# Altium schematic sheet TinyFoc_v1.SchDoc
size A4
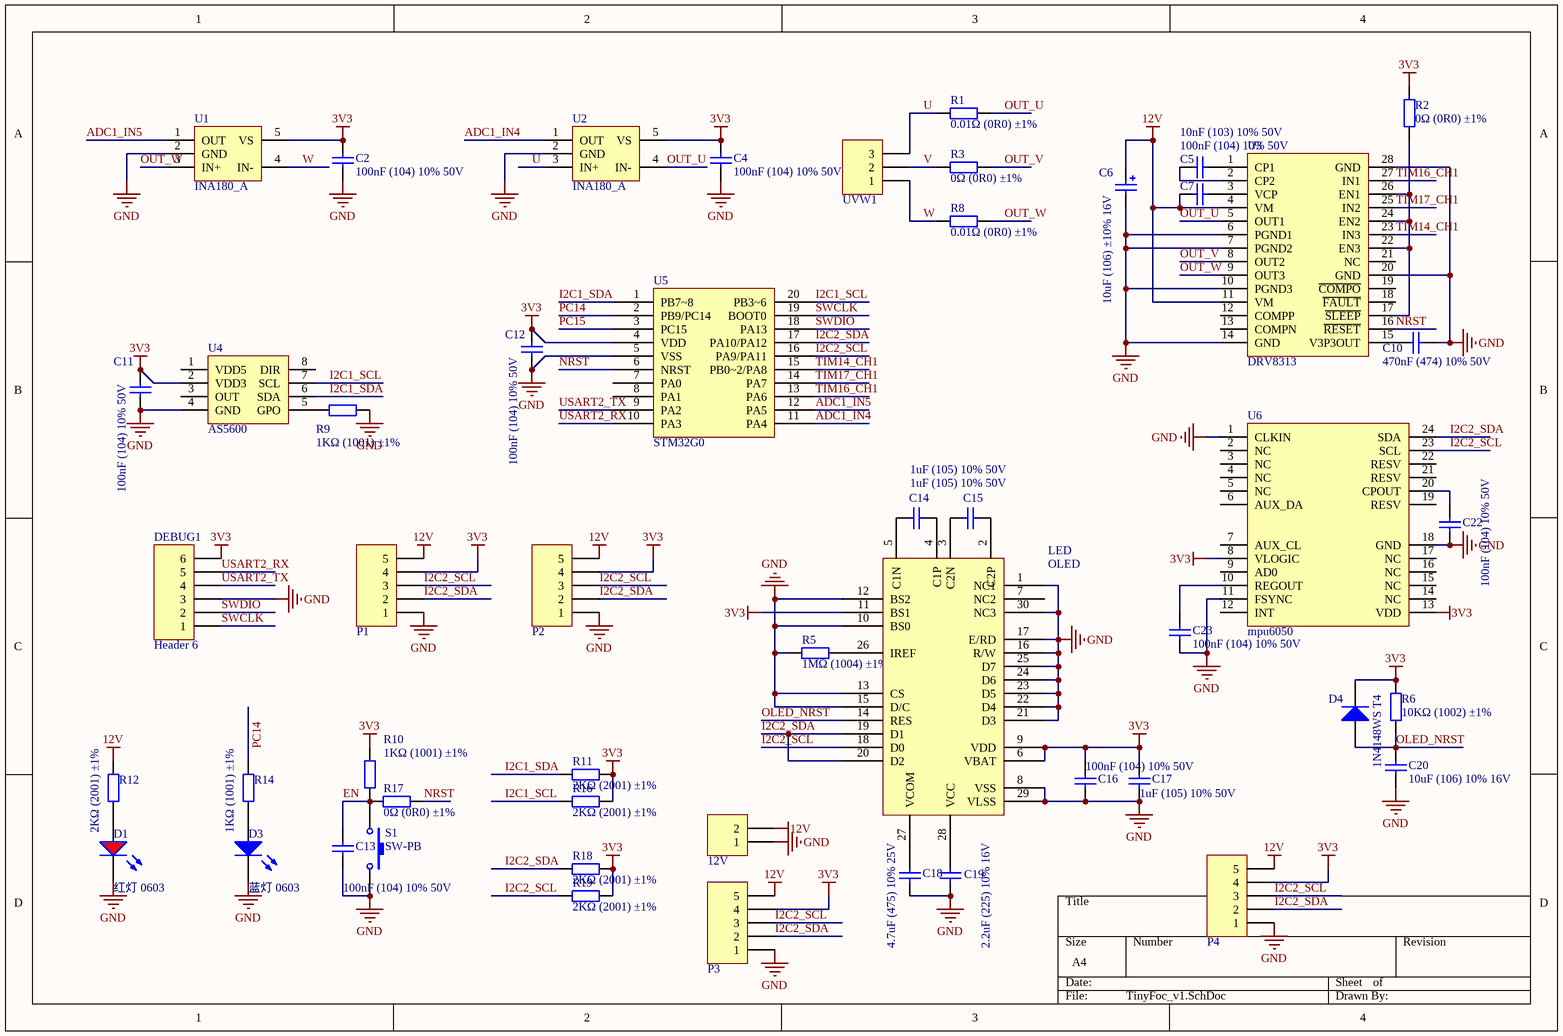
[diagram p0: TinyFoc_v1.SchDoc]

## Parts
12V  Header 2  [HDR2X1_A]  (value not drawn)
C2  100nF (104) 10% 50V  [0603_C]
C4  100nF (104) 10% 50V  [0603_C]
C5  10nF (103) 10% 50V  [0603_C]
C6  10uF (106) ±10% 16V  [CASE-B_3528]
C7  100nF (104) 10% 50V  [0603_C]
C10  470nF (474) 10% 50V  [0805_C]
C11  100nF (104) 10% 50V  [0603_C]
C12  100nF (104) 10% 50V  [0603_C]
C13  100nF (104) 10% 50V  [0603_C]
C14  1uF (105) 10% 50V  [0603_C]
C15  1uF (105) 10% 50V  [0603_C]
C16  100nF (104) 10% 50V  [0603_C]
C17  1uF (105) 10% 50V  [0603_C]
C18  4.7uF (475) 10% 25V  [0805_C]
C19  2.2uF (225) 10% 16V  [0603_C]
C20  10uF (106) 10% 16V  [0805_C]
C22  100nF (104) 10% 50V  [0603_C]
C23  100nF (104) 10% 50V  [0603_C]
D1  红灯 0603  [0603_LED_S1]
D3  蓝灯 0603  [0603_LED_S1]
D4  1N4148WS T4  [SOD-323]
DEBUG1  Header 6  [HDR6X1_A_2.0]
LED  OLED  [OLED_pin30]
P1  Header 5  [HDR5_1.27_A]  (value not drawn)
P2  Header 5  [HDR5_1.27_A]  (value not drawn)
P3  Header 5  [HDR5_1.27_A]  (value not drawn)
P4  Header 5  [HDR5_1.27_B]  (value not drawn)
R1  0.01Ω (0R0) ±1%  [0805_R]
R2  0Ω (0R0) ±1%  [0402_R]
R3  0Ω (0R0) ±1%  [0805_R]
R5  1MΩ (1004) ±1%  [0603_R]
R6  10KΩ (1002) ±1%  [0603_R]
R8  0.01Ω (0R0) ±1%  [0805_R]
R9  1KΩ (1001) ±1%  [0603_R]
R10  1KΩ (1001) ±1%  [0603_R]
R11  2KΩ (2001) ±1%  [0603_R]
R12  2KΩ (2001) ±1%  [0805_R]
R14  1KΩ (1001) ±1%  [0603_R]
R16  2KΩ (2001) ±1%  [0603_R]
R17  0Ω (0R0) ±1%  [0402_R]
R18  2KΩ (2001) ±1%  [0603_R]
R19  2KΩ (2001) ±1%  [0603_R]
S1  SW-PB  [SW_PB2_3*5]
U1  INA180_A  [SOT23]
U2  INA180_A  [SOT23]
U3  DRV8313  [TSSOP-28p]
U4  AS5600  [SOP-8N]
U5  STM32G0  [STM8S103]
U6  mpu6050  [QFN50P400X400X80_HS-25N]
UVW1  Header 3  [HDR3X1_A]  (value not drawn)

## Nets
3V3: C2.2 C4.2 C11.2 C12.2 C16.2 C17.2 D4.2(K) DEBUG1.6 LED.6(VBAT) LED.9(VDD) LED.11(BS1) P1.4 P2.4 P3.4 P4.4 R2.1 R6.2 R10.2 R11.1 R16.1 R18.1 R19.1 U1.5(VS) U2.5(VS) U4.2(VDD3) U5.4(VDD) U6.8(VLOGIC) U6.13(VDD)
12V: 12V.2 C6.1 C7.1 P1.5 P2.5 P3.5 P4.5 R12.2 U3.4(VM) U3.11(VM)
GND: 12V.1 C2.1 C4.1 C6.2 C10.2 C11.1 C12.1 C13.1 C16.1 C17.1 C18.1 C19.1 C20.1 C22.1 C23.1 D1.K D3.K DEBUG1.3 LED.1(NC1) LED.8(VSS) LED.10(BS0) LED.12(BS2) LED.13(CS) LED.15(D/C) LED.16(R/W) LED.17(E/RD) LED.21(D3) LED.22(D4) LED.23(D5) LED.24(D6) LED.25(D7) LED.29(VLSS) LED.30(NC3) P1.1 P2.1 P3.1 P4.1 R5.1 R9.2 S1.2 U1.2(GND) U2.2(GND) U3.6(PGND1) U3.7(PGND2) U3.10(PGND3) U3.14(GND) U3.20(GND) U3.28(GND) U4.4(GND) U5.5(VSS) U6.1(CLKIN) U6.11(FSYNC) U6.18(GND)
ADC1_IN4: U2.1(OUT) U5.11(PA4)
ADC1_IN5: U1.1(OUT) U5.12(PA5)
EN: C13.2 R10.1 R17.2 S1.1
I2C1_SCL: R16.2 U4.7(SCL) U5.20(PB3~6)
I2C1_SDA: R11.2 U4.6(SDA) U5.1(PB7~8)
I2C2_SCL: LED.18(D0) P1.3 P2.3 P3.3 P4.3 R19.2 U5.16(PA9/PA11) U6.23(SCL)
I2C2_SDA: LED.19(D1) LED.20(D2) P1.2 P2.2 P3.2 P4.2 R18.2 U5.17(PA10/PA12) U6.24(SDA)
NRST: R17.1 U3.16(~{RESET}) U5.6(NRST)
OLED_NRST: C20.2 D4.1(A) LED.14(RES) R6.1
OUT_U: R1.2 U2.4(IN-) U3.5(OUT1)
OUT_V: R3.2 U3.8(OUT2)
OUT_W: R8.2 U1.3(IN+) U3.9(OUT3)
PC14: R14.1 U5.2(PB9/PC14)
PC15: U5.3(PC15)
SWCLK: DEBUG1.1 U5.19(BOOT0)
SWDIO: DEBUG1.2 U5.18(PA13)
TIM14_CH1: U3.23(IN3) U5.15(PB0~2/PA8)
TIM16_CH1: U3.27(IN1) U5.13(PA6)
TIM17_CH1: U3.25(IN2) U5.14(PA7)
U: R1.1 U2.3(IN+) UVW1.3
USART2_RX: DEBUG1.5 U5.10(PA3)
USART2_TX: DEBUG1.4 U5.9(PA2)
V: R3.1 UVW1.2
W: R8.1 U1.4(IN-) UVW1.1
NetC5_1: C5.1 U3.1(CP1)
NetC5_2: C5.2 U3.2(CP2)
NetC7_2: C7.2 U3.3(VCP)
NetC10_1: C10.1 U3.15(V3P3OUT)
NetC14_1: C14.1 LED.5(C1N)
NetC14_2: C14.2 LED.4(C1P)
NetC15_1: C15.1 LED.3(C2N)
NetC15_2: C15.2 LED.2(C2P)
NetC18_2: C18.2 LED.27(VCOM)
NetC19_2: C19.2 LED.28(VCC)
NetC22_2: C22.2 U6.20(CPOUT)
NetC23_2: C23.2 U6.10(REGOUT)
NetD1_A: D1.A R12.1
NetD3_A: D3.A R14.2
NetLED_26: LED.26(IREF) R5.2
NetR2_2: R2.2 U3.17(~{SLEEP}) U3.22(EN3) U3.24(EN2) U3.26(EN1)
NetR9_1: R9.1 U4.5(GPO)

Not connected (* = marked no-connect by the designer): LED 7(NC2); U3 12(COMPP) 13(COMPN) 18(~{FAULT}) 19(~{COMPO}) 21(NC); U4 1(VDD5) 3(OUT) 8(DIR); U5 7(PA0) 8(PA1); U6 2(NC) 3(NC) 4(NC) 5(NC) 6(AUX_DA) 7(AUX_CL) 9(AD0) 12(INT) 14(NC) 15(NC) 16(NC) 17(NC) 19(RESV) 21(RESV) 22(RESV)

## Library data of the parts
12V = Header 2: 接插件; LatestRevisionDate: 17-Jul-2002; LatestRevisionNote: Re-released for DXP Platform.; Publisher: Altium Limited
C2 C4 C7 C11-C13 C16 C22 C23 = 0603 100nF (104) 10% 50V: 贴片电容; ComponentLink1Description: 供应商链接; ComponentLink1URL: http://www.szlcsc.com/product/details_15331.html; Package: 0603; Supplier: LC; SuppliersPartNumber: C14663
C5 = 0603 10nF (103) 10% 50V: 贴片电容; ComponentLink1Description: 供应商链接; ComponentLink1URL: http://www.szlcsc.com/product/details_58143.html; Package: 0603; Supplier: LC; SuppliersPartNumber: C57112
C6 = 3528 100uF (107) 10% 6.3V: 钽电容; ComponentLink1Description: 供应商链接; ComponentLink1URL: http://www.szlcsc.com/product/details_16815.html; Package: 3528; Supplier: LC; SuppliersPartNumber: C16133
C10 = 0805 470nF (474) 10% 50V: 贴片电容; ComponentLink1Description: 供应商链接; ComponentLink1URL: http://www.szlcsc.com/product/details_14623.html; Package: 0805; Supplier: LC; SuppliersPartNumber: C13967
C14 C15 C17 = 0603 1uF (105) 10% 50V: 贴片电容; ComponentLink1Description: 供应商链接; ComponentLink1URL: http://www.szlcsc.com/product/details_16531.html; Package: 0603; Supplier: LC; SuppliersPartNumber: C15849
C18 = 0805 4.7uF (475) 10% 25V: 贴片电容; ComponentLink1Description: 供应商链接; ComponentLink1URL: http://www.szlcsc.com/product/details_2131.html; Package: 0805; Supplier: LC; SuppliersPartNumber: C1779
C19 = 0603 2.2uF (225) 10% 16V: 贴片电容; ComponentLink1Description: 供应商链接; ComponentLink1URL: http://www.szlcsc.com/product/details_24366.html; Package: 0603; Supplier: LC; SuppliersPartNumber: C23630
C20 = 0805 10uF (106) 10% 25V: 贴片电容; ComponentLink1Description: 供应商链接; ComponentLink1URL: http://www.szlcsc.com/product/details_16532.html; Package: 0805; Supplier: LC; SuppliersPartNumber: C15850
D1 = 0603 红灯: 发光二极管; ComponentLink1Description: 供应商链接; ComponentLink1URL: http://www.szlcsc.com/product/details_2659.html; Package: 0603; Supplier: LC; SuppliersPartNumber: C2286
D3 = 0603 蓝灯: 发光二极管; ComponentLink1Description: 供应商链接; ComponentLink1URL: http://www.szlcsc.com/product/details_73150.html; Package: 0603; Supplier: LC; SuppliersPartNumber: C72041
D4 = SOD-323 1N4148WS T4: 二极管; ComponentLink1Description: 供应商链接; ComponentLink1URL: http://www.szlcsc.com/product/details_2485.html; Package: SOD-323; Supplier: LC; SuppliersPartNumber: C2128
DEBUG1 = Header 6: 接插件; LatestRevisionDate: 17-Jul-2002; LatestRevisionNote: Re-released for DXP Platform.; Publisher: Altium Limited
LED = OLED: OLED显示屏12864
P1-P4 = Header 5: 接插件-1.27; LatestRevisionDate: 17-Jul-2002; LatestRevisionNote: Re-released for DXP Platform.; Publisher: Altium Limited
R1 R3 R8 = 0805 0Ω (0R0) 1%: 贴片电阻; ComponentLink1Description: 供应商链接; ComponentLink1URL: http://www.szlcsc.com/product/details_18165.html; Package: 0805; Supplier: LC; SuppliersPartNumber: C17477
R2 R17 = 0402 0Ω (0R0) 1%: 贴片电阻; ComponentLink1Description: 供应商链接; ComponentLink1URL: http://www.szlcsc.com/product/details_17853.html; Package: 0402; Supplier: LC; SuppliersPartNumber: C17168
R5 = 0603 1MΩ (1004) 1%: 贴片电阻; ComponentLink1Description: 供应商链接; ComponentLink1URL: http://www.szlcsc.com/product/details_23662.html; Package: 0603; Supplier: LC; SuppliersPartNumber: C22935
R6 = 0603 10KΩ (1002) 1%: 贴片电阻; ComponentLink1Description: 供应商链接; ComponentLink1URL: http://www.szlcsc.com/product/details_26547.html; Package: 0603; Supplier: LC; SuppliersPartNumber: C25804
R9 R10 R14 = 0603 1KΩ (1001) 1%: 贴片电阻; ComponentLink1Description: 供应商链接; ComponentLink1URL: http://www.szlcsc.com/product/details_21904.html; Package: 0603; Supplier: LC; SuppliersPartNumber: C21190
R11 R16 R18 R19 = 0603 2KΩ (2001) 1%: 贴片电阻; ComponentLink1Description: 供应商链接; ComponentLink1URL: http://www.szlcsc.com/product/details_23702.html; Package: 0603; Supplier: LC; SuppliersPartNumber: C22975
R12 = 0805 2KΩ (2001) 1%: 贴片电阻; ComponentLink1Description: 供应商链接; ComponentLink1URL: http://www.szlcsc.com/product/details_18292.html; Package: 0805; Supplier: LC; SuppliersPartNumber: C17604
S1 = SW-PB: 微动开关; Published: 24-Mar-1999; LatestRevisionDate: 17-Jul-2002; LatestRevisionNote: Re-released for DXP Platform.; PackageReference: SPST-2; Publisher: Altium Limited
U1 U2 = INA180_A: 电流检测
U3 = DRV8313: 无刷电机驱动芯片
U4 = AS5600: 磁编码器
U5 = STM32G0: STM32单片机20引脚
UVW1 = Header 3: 接插件; LatestRevisionDate: 17-Jul-2002; LatestRevisionNote: Re-released for DXP Platform.; Publisher: Altium Limited